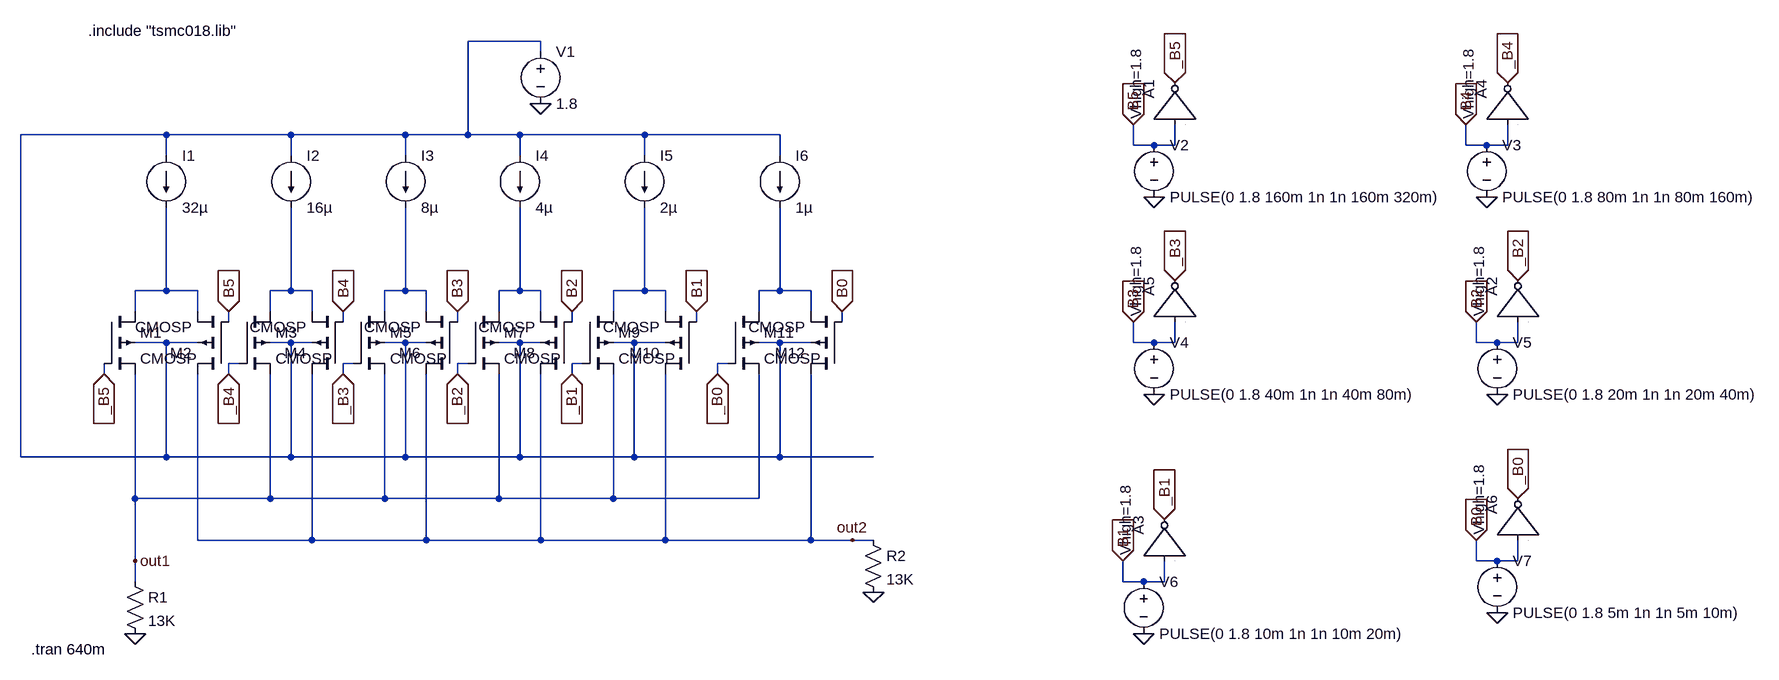
[diagram p0: schematic diff_ideal_dac2.asc]
diff_ideal_dac2.asc, the LTspice schematic file:
Version 4
SHEET 1 2348 776
WIRE 368 -176 256 -176
WIRE 368 -160 368 -176
WIRE -208 -32 -432 -32
WIRE -16 -32 -208 -32
WIRE 160 -32 -16 -32
WIRE 256 -32 256 -176
WIRE 256 -32 160 -32
WIRE 336 -32 256 -32
WIRE 528 -32 336 -32
WIRE 736 -32 528 -32
WIRE 1280 -16 1280 -48
WIRE 1312 -16 1280 -16
WIRE 1344 -16 1344 -48
WIRE 1344 -16 1312 -16
WIRE 1792 -16 1792 -48
WIRE 1824 -16 1792 -16
WIRE 1856 -16 1856 -48
WIRE 1856 -16 1824 -16
WIRE -208 0 -208 -32
WIRE -16 0 -16 -32
WIRE 160 0 160 -32
WIRE 336 0 336 -32
WIRE 528 0 528 -32
WIRE 736 0 736 -32
WIRE -208 208 -208 80
WIRE -208 208 -256 208
WIRE -160 208 -208 208
WIRE -16 208 -16 80
WIRE -16 208 -48 208
WIRE 16 208 -16 208
WIRE 160 208 160 80
WIRE 160 208 128 208
WIRE 192 208 160 208
WIRE 336 208 336 80
WIRE 336 208 304 208
WIRE 368 208 336 208
WIRE 528 208 528 80
WIRE 528 208 480 208
WIRE 560 208 528 208
WIRE 736 208 736 80
WIRE 736 208 704 208
WIRE 784 208 736 208
WIRE -256 240 -256 208
WIRE -160 240 -160 208
WIRE -48 240 -48 208
WIRE 16 240 16 208
WIRE 128 240 128 208
WIRE 192 240 192 208
WIRE 304 240 304 208
WIRE 368 240 368 208
WIRE 480 240 480 208
WIRE 560 240 560 208
WIRE 704 240 704 208
WIRE 784 240 784 208
WIRE -112 256 -112 240
WIRE 64 256 64 240
WIRE 240 256 240 240
WIRE 416 256 416 240
WIRE 608 256 608 240
WIRE 832 256 832 240
WIRE -208 288 -256 288
WIRE -160 288 -208 288
WIRE -16 288 -48 288
WIRE 16 288 -16 288
WIRE 160 288 128 288
WIRE 192 288 160 288
WIRE 336 288 304 288
WIRE 368 288 336 288
WIRE 512 288 480 288
WIRE 560 288 512 288
WIRE 736 288 704 288
WIRE 784 288 736 288
WIRE 1280 288 1280 256
WIRE 1312 288 1280 288
WIRE 1344 288 1344 256
WIRE 1344 288 1312 288
WIRE 1808 288 1808 256
WIRE 1840 288 1808 288
WIRE 1872 288 1872 256
WIRE 1872 288 1840 288
WIRE -96 320 -112 320
WIRE 80 320 64 320
WIRE 256 320 240 320
WIRE 432 320 416 320
WIRE 656 320 640 320
WIRE -304 336 -304 320
WIRE -112 336 -112 320
WIRE 64 336 64 320
WIRE 240 336 240 320
WIRE 416 336 416 320
WIRE 640 336 640 320
WIRE -432 464 -432 -32
WIRE -208 464 -208 288
WIRE -208 464 -432 464
WIRE -16 464 -16 288
WIRE -16 464 -208 464
WIRE 160 464 160 288
WIRE 160 464 -16 464
WIRE 336 464 336 288
WIRE 336 464 160 464
WIRE 512 464 512 288
WIRE 512 464 336 464
WIRE 736 464 736 288
WIRE 736 464 512 464
WIRE 880 464 736 464
WIRE -256 528 -256 336
WIRE -48 528 -48 336
WIRE -48 528 -256 528
WIRE 128 528 128 336
WIRE 128 528 -48 528
WIRE 304 528 304 336
WIRE 304 528 128 528
WIRE 480 528 480 336
WIRE 480 528 304 528
WIRE 704 528 704 336
WIRE 704 528 480 528
WIRE -160 592 -160 336
WIRE 16 592 16 336
WIRE 16 592 -160 592
WIRE 192 592 192 336
WIRE 192 592 16 592
WIRE 368 592 368 336
WIRE 368 592 192 592
WIRE 560 592 560 336
WIRE 560 592 368 592
WIRE 784 592 784 336
WIRE 784 592 560 592
WIRE 848 592 784 592
WIRE 880 592 848 592
WIRE -256 624 -256 528
WIRE 1808 624 1808 592
WIRE 1840 624 1808 624
WIRE 1872 624 1872 592
WIRE 1872 624 1840 624
WIRE -256 656 -256 624
WIRE 1264 656 1264 624
WIRE 1296 656 1264 656
WIRE 1328 656 1328 624
WIRE 1328 656 1296 656
FLAG 368 -80 0
FLAG -304 336 _B5
IOPIN -304 336 In
FLAG -112 336 _B4
IOPIN -112 336 In
FLAG 64 336 _B3
IOPIN 64 336 In
FLAG 240 336 _B2
IOPIN 240 336 In
FLAG 416 336 _B1
IOPIN 416 336 In
FLAG 640 336 _B0
IOPIN 640 336 In
FLAG -112 240 B5
IOPIN -112 240 In
FLAG 64 240 B4
IOPIN 64 240 In
FLAG 240 240 B3
IOPIN 240 240 In
FLAG 416 240 B2
IOPIN 416 240 In
FLAG 608 240 B1
IOPIN 608 240 In
FLAG 832 240 B0
IOPIN 832 240 In
FLAG -256 736 0
FLAG 1840 368 0
FLAG 1296 736 0
FLAG 1840 704 0
FLAG 1312 368 0
FLAG 1824 64 0
FLAG 1312 64 0
FLAG 1344 -112 _B5
IOPIN 1344 -112 In
FLAG 1280 -48 B5
IOPIN 1280 -48 In
FLAG 1792 -48 B4
IOPIN 1792 -48 In
FLAG 1856 -112 _B4
IOPIN 1856 -112 In
FLAG 1280 256 B3
IOPIN 1280 256 In
FLAG 1344 192 _B3
IOPIN 1344 192 In
FLAG 1808 592 B0
IOPIN 1808 592 In
FLAG 1872 528 _B0
IOPIN 1872 528 In
FLAG 1264 624 B1
IOPIN 1264 624 In
FLAG 1328 560 _B1
IOPIN 1328 560 In
FLAG 1808 256 B2
IOPIN 1808 256 In
FLAG 1872 192 _B2
IOPIN 1872 192 In
FLAG 880 672 0
FLAG -256 624 out1
FLAG 848 592 out2
SYMBOL current -208 0 R0
WINDOW 123 0 0 Left 0
WINDOW 39 0 0 Left 0
SYMATTR InstName I1
SYMATTR Value 32µ
SYMBOL current -16 0 R0
WINDOW 123 0 0 Left 0
WINDOW 39 0 0 Left 0
SYMATTR InstName I2
SYMATTR Value 16µ
SYMBOL current 160 0 R0
WINDOW 123 0 0 Left 0
WINDOW 39 0 0 Left 0
SYMATTR InstName I3
SYMATTR Value 8µ
SYMBOL current 336 0 R0
WINDOW 123 0 0 Left 0
WINDOW 39 0 0 Left 0
SYMATTR InstName I4
SYMATTR Value 4µ
SYMBOL current 528 0 R0
WINDOW 123 0 0 Left 0
WINDOW 39 0 0 Left 0
SYMATTR InstName I5
SYMATTR Value 2µ
SYMBOL current 736 0 R0
WINDOW 123 0 0 Left 0
WINDOW 39 0 0 Left 0
SYMATTR InstName I6
SYMATTR Value 1µ
SYMBOL voltage 368 -176 R0
WINDOW 123 0 0 Left 0
WINDOW 39 0 0 Left 0
SYMATTR InstName V1
SYMATTR Value 1.8
SYMBOL cmosp -304 240 R0
SYMATTR InstName M1
SYMATTR Value2 l=180n w=32u
SYMBOL cmosp -112 336 R180
SYMATTR InstName M2
SYMATTR Value2 l=180n w=32u
SYMBOL cmosp -96 240 R0
SYMATTR InstName M3
SYMATTR Value2 l=180n w=16u
SYMBOL cmosp 64 336 R180
SYMATTR InstName M4
SYMATTR Value2 l=180n w=16u
SYMBOL cmosp 80 240 R0
SYMATTR InstName M5
SYMATTR Value2 l=180n w=8u
SYMBOL cmosp 240 336 R180
SYMATTR InstName M6
SYMATTR Value2 l=180n w=8u
SYMBOL cmosp 256 240 R0
SYMATTR InstName M7
SYMATTR Value2 l=180n w=4u
SYMBOL cmosp 416 336 R180
SYMATTR InstName M8
SYMATTR Value2 l=180n w=4u
SYMBOL cmosp 432 240 R0
SYMATTR InstName M9
SYMATTR Value2 l=180n w=2u
SYMBOL cmosp 608 336 R180
SYMATTR InstName M10
SYMATTR Value2 l=180n w=2u
SYMBOL cmosp 656 240 R0
SYMATTR InstName M11
SYMATTR Value2 l=180n w=1u
SYMBOL cmosp 832 336 R180
SYMATTR InstName M12
SYMATTR Value2 l=180n w=1u
SYMBOL res -272 640 R0
SYMATTR InstName R1
SYMATTR Value 13K
SYMBOL voltage 1312 -32 R0
WINDOW 123 0 0 Left 0
WINDOW 39 0 0 Left 0
SYMATTR InstName V2
SYMATTR Value PULSE(0 1.8 160m 1n 1n 160m 320m)
SYMBOL voltage 1824 -32 R0
WINDOW 123 0 0 Left 0
WINDOW 39 0 0 Left 0
SYMATTR InstName V3
SYMATTR Value PULSE(0 1.8 80m 1n 1n 80m 160m)
SYMBOL voltage 1312 272 R0
WINDOW 123 0 0 Left 0
WINDOW 39 0 0 Left 0
SYMATTR InstName V4
SYMATTR Value PULSE(0 1.8 40m 1n 1n 40m 80m)
SYMBOL voltage 1296 640 R0
WINDOW 123 0 0 Left 0
WINDOW 39 0 0 Left 0
SYMATTR InstName V6
SYMATTR Value PULSE(0 1.8 10m 1n 1n 10m 20m)
SYMBOL voltage 1840 608 R0
WINDOW 123 0 0 Left 0
WINDOW 39 0 0 Left 0
SYMATTR InstName V7
SYMATTR Value PULSE(0 1.8 5m 1n 1n 5m 10m)
SYMBOL voltage 1840 272 R0
WINDOW 123 0 0 Left 0
WINDOW 39 0 0 Left 0
SYMATTR InstName V5
SYMATTR Value PULSE(0 1.8 20m 1n 1n 20m 40m)
SYMBOL Digital\\inv 1280 -48 R270
WINDOW 3 8 4 Left 2
SYMATTR Value Vhigh=1.8
SYMATTR InstName A1
SYMBOL Digital\\inv 1808 256 R270
WINDOW 3 8 4 Left 2
SYMATTR Value Vhigh=1.8
SYMATTR InstName A2
SYMBOL Digital\\inv 1264 624 R270
WINDOW 3 8 4 Left 2
SYMATTR Value Vhigh=1.8
SYMATTR InstName A3
SYMBOL Digital\\inv 1792 -48 R270
WINDOW 3 8 4 Left 2
SYMATTR Value Vhigh=1.8
SYMATTR InstName A4
SYMBOL Digital\\inv 1280 256 R270
WINDOW 3 8 4 Left 2
SYMATTR Value Vhigh=1.8
SYMATTR InstName A5
SYMBOL Digital\\inv 1808 592 R270
WINDOW 3 8 4 Left 2
SYMATTR Value Vhigh=1.8
SYMATTR InstName A6
SYMBOL res 864 576 R0
SYMATTR InstName R2
SYMATTR Value 13K
TEXT -328 -192 Left 2 !.include "tsmc018.lib"
TEXT -416 760 Left 2 !.tran 640m

The netlist it stands for:
* diff_ideal_dac2.asc
I1 N001 N002 32µ
I2 N001 N003 16µ
I3 N001 N004 8µ
I4 N001 N005 4µ
I5 N001 N006 2µ
I6 N001 N007 1µ
V1 N001 0 1.8
M1 N002 _B5 out1 N001 CMOSP l=180n w=32u
M2 out2 B5 N002 N001 CMOSP l=180n w=32u
M3 N003 _B4 out1 N001 CMOSP l=180n w=16u
M4 out2 B4 N003 N001 CMOSP l=180n w=16u
M5 N004 _B3 out1 N001 CMOSP l=180n w=8u
M6 out2 B3 N004 N001 CMOSP l=180n w=8u
M7 N005 _B2 out1 N001 CMOSP l=180n w=4u
M8 out2 B2 N005 N001 CMOSP l=180n w=4u
M9 N006 _B1 out1 N001 CMOSP l=180n w=2u
M10 out2 B1 N006 N001 CMOSP l=180n w=2u
M11 N007 _B0 out1 N001 CMOSP l=180n w=1u
M12 out2 B0 N007 N001 CMOSP l=180n w=1u
R1 out1 0 13K
V2 B5 0 PULSE(0 1.8 160m 1n 1n 160m 320m)
V3 B4 0 PULSE(0 1.8 80m 1n 1n 80m 160m)
V4 B3 0 PULSE(0 1.8 40m 1n 1n 40m 80m)
V6 B1 0 PULSE(0 1.8 10m 1n 1n 10m 20m)
V7 B0 0 PULSE(0 1.8 5m 1n 1n 5m 10m)
V5 B2 0 PULSE(0 1.8 20m 1n 1n 20m 40m)
A1 B5 0 0 0 0 _B5 0 0 BUF Vhigh=1.8
A2 B2 0 0 0 0 _B2 0 0 BUF Vhigh=1.8
A3 B1 0 0 0 0 _B1 0 0 BUF Vhigh=1.8
A4 B4 0 0 0 0 _B4 0 0 BUF Vhigh=1.8
A5 B3 0 0 0 0 _B3 0 0 BUF Vhigh=1.8
A6 B0 0 0 0 0 _B0 0 0 BUF Vhigh=1.8
R2 out2 0 13K
.model NMOS NMOS
.model PMOS PMOS
.lib standard.mos
.include "tsmc018.lib"
.tran 640m
.backanno
.end